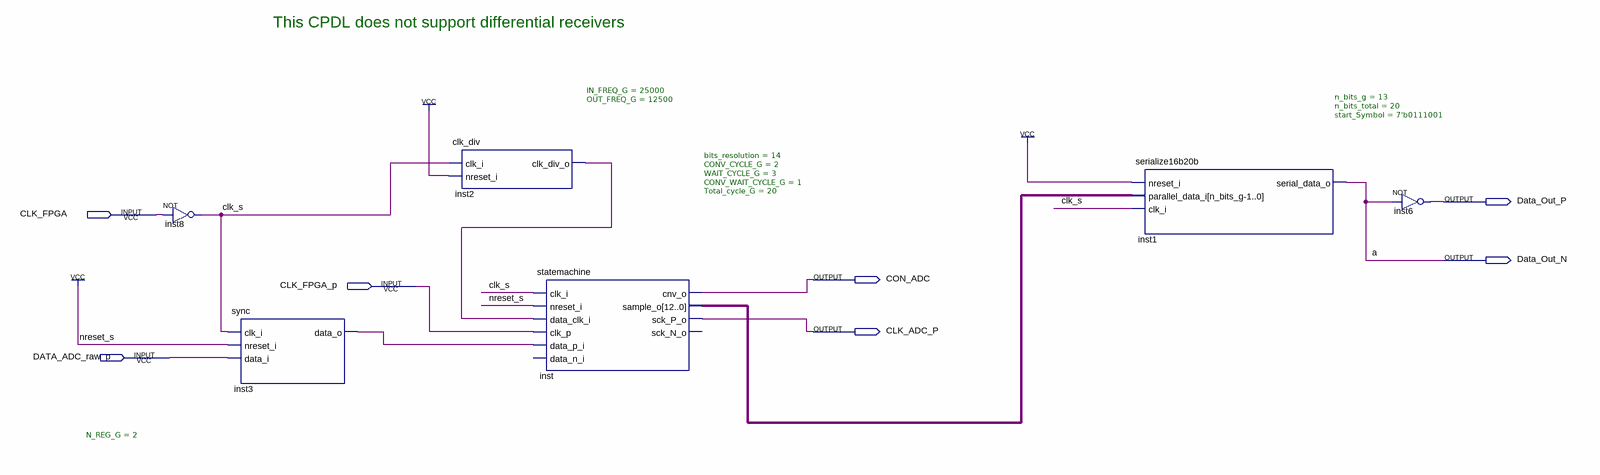
[diagram p0: schematic sheet]
// Quartus schematic CPLD_current_top.bdf as structural Verilog: 6 symbols, 7 pins
module CPLD_current_top (
  input  CLK_FPGA,
  input  CLK_FPGA_p,
  input  DATA_ADC_raw_p,
  output Data_Out_P,
  output Data_Out_N,
  output CON_ADC,
  output CLK_ADC_P
);

  wire clk_s, inst2_clk_div_o, inst3_data_o;
  wire [12:0] inst_sample_o;

  not inst8 (clk_s, CLK_FPGA);
  sync #(.N_REG_G(2)) inst3 (.clk_i(clk_s), .nreset_i(1'b1), .data_i(DATA_ADC_raw_p), .data_o(inst3_data_o));
  clk_div #(.IN_FREQ_G(25000), .OUT_FREQ_G(12500)) inst2 (.clk_i(clk_s), .nreset_i(1'b1), .clk_div_o(inst2_clk_div_o));
  statemachine #(.bits_resolution(14), .CONV_CYCLE_G(2), .WAIT_CYCLE_G(3), .CONV_WAIT_CYCLE_G(1), .Total_cycle_G(20)) inst (
    .clk_i(clk_s), .nreset_i(1'b1), .data_clk_i(inst2_clk_div_o), .clk_p(CLK_FPGA_p),
    .data_p_i(inst3_data_o), .cnv_o(CON_ADC), .sample_o(inst_sample_o), .sck_P_o(CLK_ADC_P));  // open: data_n_i, sck_N_o
  serialize16b20b #(.n_bits_g(13), .n_bits_total(20), .start_Symbol(7'b0111001)) inst1 (
    .nreset_i(1'b1), .parallel_data_i(inst_sample_o), .clk_i(clk_s), .serial_data_o(Data_Out_N));
  not inst6 (Data_Out_P, Data_Out_N);

  // Other names for the same wires on the sheet: a = Data_Out_N

  // Notes on the sheet:
  //   This CPDL does not support differential receivers
endmodule
